# Altium project wulpus_hv_mux.PrjPcb
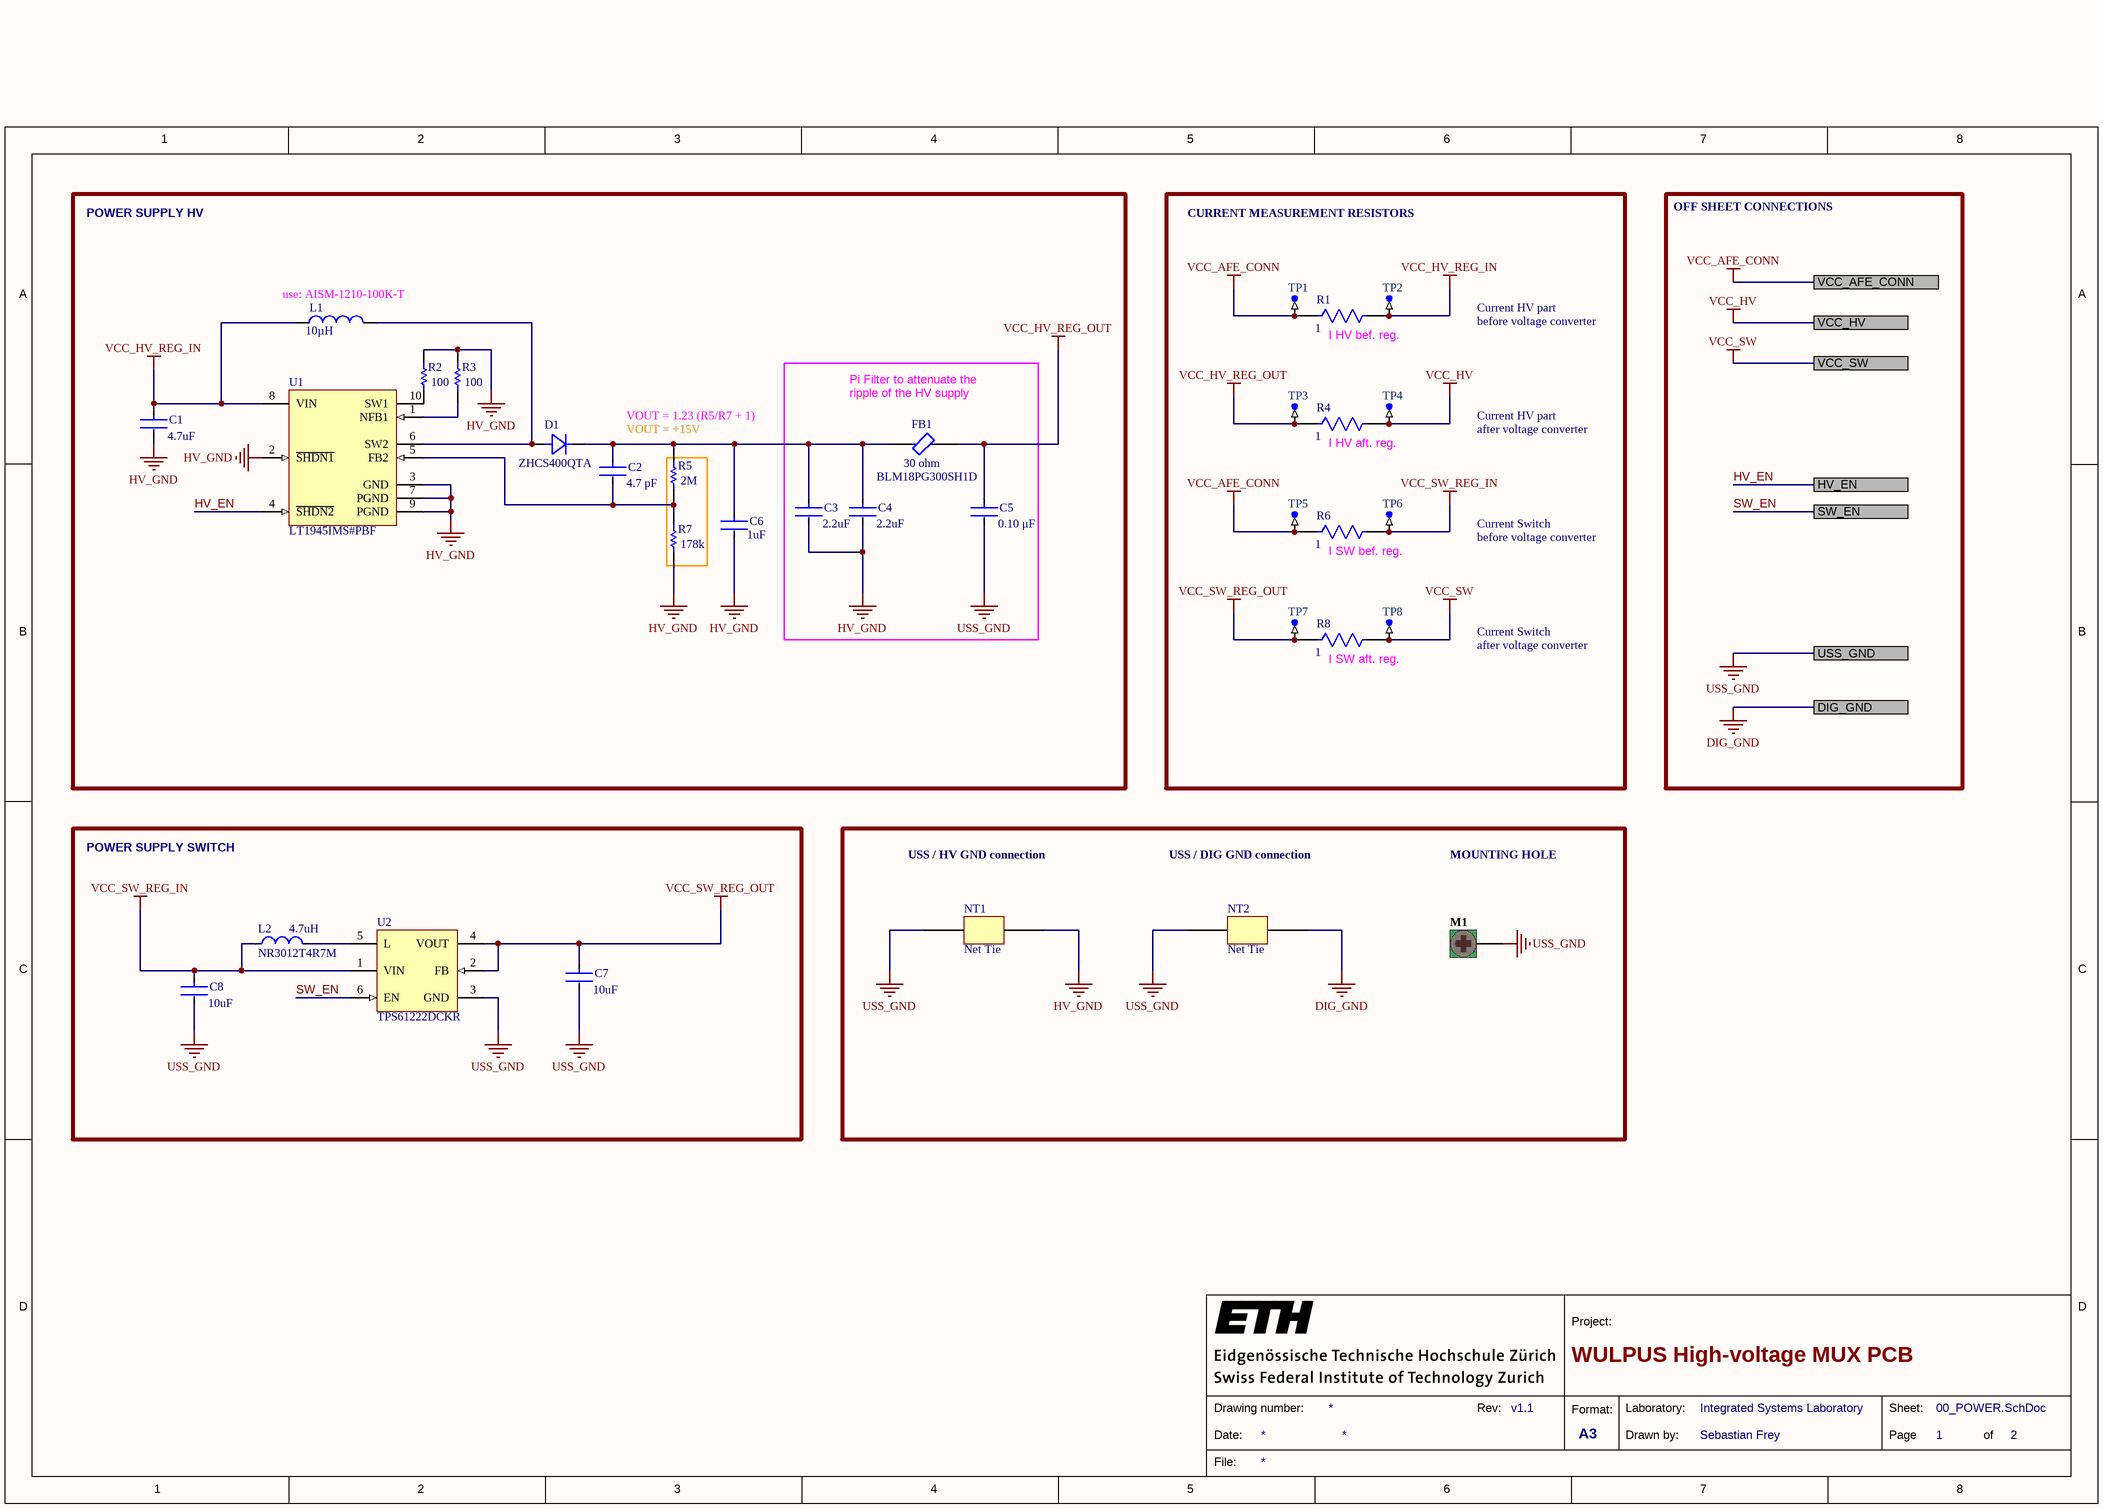
[diagram p0: 00_POWER.SchDoc]
2 sheets, 71 parts. Net scope: flat (ports and power ports of the same name join across sheets).
Board file: PCB1.PcbDoc
Sheets:
  00_POWER.SchDoc
  01_TRANSDUCERS.SchDoc

## Sheet 00_POWER.SchDoc: WULPUS High-voltage MUX PCB
size A3; DrawnBy: Sebastian Frey; Organization: Integrated Systems Laboratory; Revision: v1.1; SheetNumber: 1; SheetTotal: 2

### Parts
C1  Capacitance: 4.7uF  [FP-0603-L_1_6_0_15-W_0_81-MFG]  (hidden comment: 06036D475KAT2A)
C2  Capacitance: 4.7 pF  [FP-C0402-BB-MFG]  (hidden comment: C0402C479C5GACTU)
C3  Capacitance: 2.2uF  [FP-GRM188-0_2-IPC_C]  (hidden comment: GRM188R61H225KE11D)
C4  Capacitance: 2.2uF  [FP-GRM188-0_2-IPC_C]  (hidden comment: GRM188R61H225KE11D)
C5  value 0.10 μF  [FP-C0603C-CF-MFG]  (hidden comment: C0603C104M5RACTU)
C6  Capacitance: 1uF  [FP-1206-L_3_2_0_15-W_1_6-IPC_B]  (hidden comment: GMK316BJ105KLHT)
C7  Capacitance: 10uF  [FP-GRM188-0_1-e0_2_0_55-IPC_A]  (hidden comment: GRM188R60J106ME47D)
C8  Capacitance: 10uF  [FP-GRM188-0_1-e0_2_0_55-IPC_A]  (hidden comment: GRM188R60J106ME47D)
D1  ZHCS400QTA  [DIODE_SOD323_DIO]
FB1  BLM18PG300SH1D  Impedance: 30 ohm  [FP-BLM18-0_15-t0_8-IPC_A]
L1  Inductance: 10µH  [TDK-B82422A1103K100_V]  (hidden comment: B82422A1103K100)
L2  NR3012T4R7M  Inductance: 4.7uH  [FP-NR3012-MFG]
M1  Mounting Hole for AFE PCB  [Hole M2]  (value not drawn)  (no BOM)
NT1  Net Tie  [Net_Tie_Top_Bottom]  (net tie, no BOM)
NT2  Net Tie  [Net_Tie_Top_Bottom]  (net tie, no BOM)
R1  Resistance: 1  [FP-CSR0402-MFG]  (hidden comment: CSR0402FK1R00)
R2  Resistance: 100  [RESC1005X40X25NL05T05]  (hidden comment: ERJ-2GEJ101X)
R3  Resistance: 100  [RESC1005X40X25NL05T05]  (hidden comment: ERJ-2GEJ101X)
R4  Resistance: 1  [FP-CSR0402-MFG]  (hidden comment: CSR0402FK1R00)
R5  Resistance: 2M  [RESC1005X40X25NL05T10]  (hidden comment: RC0402FR-072ML)
R6  Resistance: 1  [FP-CSR0402-MFG]  (hidden comment: CSR0402FK1R00)
R7  Resistance: 178k  [RESC1005X40X25ML05T05]  (hidden comment: ERJ-2RKF1783X)
R8  Resistance: 1  [FP-CSR0402-MFG]  (hidden comment: CSR0402FK1R00)
TP1  TP-SM-C-100  [TP-SM-C-100]  (value not drawn)  (no BOM)
TP2  TP-SM-C-100  [TP-SM-C-100]  (value not drawn)  (no BOM)
TP3  TP-SM-C-100  [TP-SM-C-100]  (value not drawn)  (no BOM)
TP4  TP-SM-C-100  [TP-SM-C-100]  (value not drawn)  (no BOM)
TP5  TP-SM-C-100  [TP-SM-C-100]  (value not drawn)  (no BOM)
TP6  TP-SM-C-100  [TP-SM-C-100]  (value not drawn)  (no BOM)
TP7  TP-SM-C-100  [TP-SM-C-100]  (value not drawn)  (no BOM)
TP8  TP-SM-C-100  [TP-SM-C-100]  (value not drawn)  (no BOM)
U1  LT1945IMS#PBF  [LT-MS-10_L]
U2  TPS61222DCKR  [DCK0006A_L]

### Blocks framed on the sheet
POWER SUPPLY SWITCH: C7 C8 L2 U2

### Ports
DIG_GND, HV_EN, SW_EN, USS_GND, VCC_AFE_CONN, VCC_HV, VCC_SW

### Nets
DIG_GND: NT2.2 ; port DIG_GND
HV_GND: C1.2 C3.2 C4.2 C6.2 NT1.2 R2.2 R3.2 R7.1 U1.2(~{SHDN1}) U1.3(GND) U1.7(PGND) U1.9(PGND)
USS_GND: C5.2 C7.2 C8.2 M1.1 NT1.1 NT2.1 U2.3(GND) ; port USS_GND
VCC_AFE_CONN: R1.1 R6.1 TP1.1 TP5.1 ; port VCC_AFE_CONN
VCC_HV: R4.2 TP4.1 ; port VCC_HV
VCC_HV_REG_IN: C1.1 L1.1 R1.2 TP2.1 U1.8(VIN)
VCC_HV_REG_OUT: C5.1 FB1.2 R4.1 TP3.1
VCC_SW: R8.2 TP8.1 ; port VCC_SW
VCC_SW_REG_IN: C8.1 L2.1 R6.2 TP6.1 U2.1(VIN)
VCC_SW_REG_OUT: C7.1 R8.1 TP7.1 U2.2(FB) U2.4(VOUT)
HV_EN: U1.4(~{SHDN2}) ; port HV_EN
SW_EN: U2.6(EN) ; port SW_EN
NetC2_1: C2.1 C3.1 C4.1 C6.1 D1.1 FB1.1 R5.2
NetC2_2: C2.2 R5.1 R7.2 U1.5(FB2)
NetD1_2: D1.2 L1.2 U1.6(SW2)
NetL2_2: L2.2 U2.5(L)
NetR2_1: R2.1 U1.10(SW1)
NetR3_1: R3.1 U1.1(NFB1)

### Notes on the sheet
- POWER SUPPLY HV
- CURRENT MEASUREMENT RESISTORS
- OFF SHEET CONNECTIONS
- (near L1) use: AISM-1210-100K-T
- Current HV part
- (near R1) I HV bef. reg.
- before voltage converter
- VOUT = 1.23 (R5/R7 + 1)
- VOUT = +15V
- (near FB1) Pi Filter to attenuate the ripple of the HV supply
- (near R4) I HV aft. reg.
- after voltage converter
- (near R6) I SW bef. reg.
- Current Switch
- (near R8) I SW aft. reg.
- USS / HV GND connection
- USS / DIG GND connection
- MOUNTING HOLE
- 1
- 2
- 3
- 4
- 5
- 6
- 7
- 8
- A
- B
- C
- D
- Project:
- Date:
- Drawing number:
- Rev:
- Format:
- A3
- Drawn by:
- Laboratory:
- Page
- Sheet:
- of
- File:

### Library data of the parts
C1 = CMP-2006-04481-2: General Purpose Ceramic Capacitor, 0603, 4.7uF, 10%, X5R, 15%, 6.3V; Tolerance: 20%; Voltage Rating (DC): 6.3V; RoHS Compliant: Yes; Thickness: 0.035inch; Voltage: 6.3V; Number of Pins: 2; Case Code (Metric): 1608; Dielectric: X5R; Height: 0.9mm; Case Code (Imperial): 0603; Contact Plating: Tin; REACH SVHC: No SVHC; Package Quantity: 1; Case/Package: 0603; Lead Free: Lead Free; Series: -; Termination: SMD/SMT; Mount: Surface Mount; Min Operating Temperature: -55°C; Construction: Flat; Packaging: Tape and Reel; Max Operating Temperature: 85°C; Dielectric Material: Ceramic; Voltage Rating: 6.3V; Length: 1.6mm; Depth: 0.81mm; Radiation Hardening: No; Width: 0.032inch
C2 = CMP-2008-03310-2: CAP CER 4.7PF 50V NP0 0402; Manufacturer: Kemet; Material: Ceramic; Tolerance: 0.25 pF; Temperature Coefficient: 15%; Temperature Characteristic: C0G; Manufacturer Part Number: C0402C479C5GACTU; Lead Free: Yes; Device Class L1: Passive Components; ComponentLink2Description: Datasheet; Temperature: -55°C to +125°C; Digikey Description: CAP CER 4.7PF 50V NP0 0402; Ipc Land Pattern Name: CAPC10050X50; ComponentLink2URL: https://content.kemet.com/datasheets/KEM_C1002_X7R_SMD.pdf; Octopart: https://octopart.com/c0402c479c5gactu-kemet-9144199; Mouser Description: Multilayer Ceramic Capacitors MLCC - SMD/SMT 50volts 4.7pF C0G .25pF; Automotive: No; Voltage Rating: 50 V; Device Class L3: Ceramic Capacitors; Category: Cap; Value: 4.7 pF; Package: C0402-BB; Height: 0.55mm; Temperature Range Low: -55°C; RoHS: TRUE; Device Class L2: Capacitors; Temperature Range High: +125°C
C3 C4 = CMP-06035-042125-1: Chip Multilayer Ceramic Capacitors for General Purpose, 0603, 2.2uF, X5R, 15%, 10%, 50V; Case Code (Metric): 1608; Packaging: Cut Tape; REACH SVHC: No SVHC; Material: Ceramic; Voltage Rating: 50V; Min Operating Temperature: -55°C; Length: 0.063inch; Case Code (Imperial): 0603; Tolerance: 10%; Thickness: 0.039inch; Height: 0.8mm; Case/Package: 0603; Voltage Rating (DC): 50V; Dielectric: X5R; Mount: Surface Mount; Max Operating Temperature: 85°C; Width: 0.031inch
C5 = CMP-2006-03068-2: CAP CER 0.1UF 50V 20% X7R 0603; Manufacturer: KEMET; Material: Ceramic; Tolerance: 0.2; Temperature Coefficient: 30ppm/°C; Automotive Grade: Grade 1; Temperature Range High: +125°C; Voltage Rating: 50 V; Device Class L3: Ceramic Capacitors; Manufacturer Part Number: C0603C104M5RACTU; Height: 0.87mm; Category: Cap; RoHS: TRUE; Digikey Description: CAP CER 0.1UF 50V 20% X7R 0603; ComponentLink2URL: https://api.kemet.com/component-edge/download/datasheet/C0603C100J5GACAUTO.pdf; Lead Free: Yes; Temperature Range Low: -55°C; Device Class L1: Passive Components; ComponentLink2Description: Datasheet; Temperature Characteristic: X7R; Automotive: Yes; Temperature: -55°C to +125°C; Octopart: https://octopart.com/c0603c104m5ractu-kemet-11855687; Device Class L2: Capacitors; Package: C0603C-CF; Mouser Description: Multilayer Ceramic Capacitors MLCC - SMD/SMT 50volts 0.1uF X7R 20%; Capacitance: 0.10 μF
C6 = CMP-14477-003256-2: None; Voltage Rating (DC): 35V; Dielectric: X5R; Tolerance: 10%; Halogen Free: Halogen Free; Max Operating Temperature: 85°C; Min Operating Temperature: -55°C; Termination: SMD/SMT; Length: 0.126inch; Package Quantity: 2000; Voltage Rating: 35V; Width: 0.063inch; Case/Package: 1206; Case Code (Imperial): 1206; Case Code (Metric): 3216; Mount: Surface Mount; Packaging: Tape and Reel; Ratings: AEC-Q200; RoHS Compliant: Yes; Height: 1.6mm; Lead Free: Lead Free; Thickness: 0.071inch
C7 C8 = CMP-2006-02792-2: Chip Multilayer Ceramic Capacitors for General Purpose, 0603, 10uF, X5R, 15%, 20%, 6.3V; Packaging: Tape and Reel; Voltage Rating (DC): 6.3V; Width: 0.031inch; Termination: SMD/SMT; Dielectric: X5R; Package Quantity: 4000; Voltage Rating: 6.3V; Case/Package: 0603; Min Operating Temperature: -55°C; Voltage: 6.3V; Length: 1.6mm; Thickness: 0.035inch; Lead Free: Lead Free; Depth: 0.8mm; Case Code (Imperial): 0603; Max Operating Temperature: 85°C; Material: Ceramic; Height: 0.8mm; Tolerance: 20%; Mount: Surface Mount; REACH SVHC: No SVHC; Radiation Hardening: No; Case Code (Metric): 1608
D1 = ZHCS400QTA: Diode Schottky 40V 1A Automotive 2-Pin SOD-323 T/R; Manufacturer: Diodes; Supplier 1: Farnell; RoHS: Yes; Category: Rectifier Diodes; Stock 1: 385; Pricing 1: 5=0.87300, 10=0.73400, 100=0.49400, 500=0.38800 (CHF); Mount: Surface Mount; Packaging: Tape and Reel; Average Rectified Current: 1A; Max Reverse Voltage (DC): 40V; RoHS Compliant: Yes; ComponentLink1URL: http://www.mouser.com/ds/2/115/ZHCS400Q-959646.pdf?src-supplier=Mouser; ComponentLink1Description: http://www.mouser.com/ds/2/115/ZHCS400Q-959646.pdf?src-supplier=Mouser; Supplier Part Number 1: 3127490; Manufacturer Part Number: ZHCS400QTA
FB1 = CMP-06046-000808-1: Chip Ferrite Bead, 0603, 30Ω @ 100MHz, 0.05Ω, , 1A; Tolerance: 25%; Shielding: Unshielded; DC Resistance (DCR): 50mR; Number of Lines: 1; Width: 0.031inch; Termination: SMD/SMT; Case Code (Metric): 1608; Max DC Current: 1A; Case Code (Imperial): 0603; Height: 0.037inch; Max Operating Temperature: 125°C; Max Current Rating: 1A; Case/Package: 0603; Length: 1.6mm; Number of Circuits: 1; Test Frequency: 100MHz; Contact Plating: Tin; Ratings: AEC-Q200; Package Quantity: 1; Mount: Surface Mount; Packaging: Tape and Reel; Min Operating Temperature: -55°C
L1 = CMP-2000-05912-1: Wirewound Inductor, 10 uF, +/- 10%, 180 mA, -55 to 125 degC, 2-Pin SMD, RoHS, Tape and Reel; Manufacturer: EPCOS-(TDK); Frequency - Test: 1MHz; Current Rating: 180mA; Material - Core: Ferrite; DC Resistance (DCR): 1.6OhmMax; Q @ Freq: 27@2.52MHz; Frequency - Self Resonant: 25MHz; Shielding: Unshielded; Series: SIMID; Size / Dimension: 0.126"Lx0.098"W(3.20mmx2.50mm); Mounting Type: SurfaceMount; Current - Saturation: -; Operating Temperature: -; Datasheet URL: https://en.tdk.eu/inf/30/db/ind_2008/b82422a_100.pdf; Ratings: AEC-Q200; Category: Inductors,Coils,Chokes; Mounting Technology: SurfaceMount; Height - Seated (Max): 0.083"(2.10mm); Family: FixedInductors; Package / Case: 1210(3225Metric); Tolerance: ±10%; Manufacturer URL: http://www.tdk.com/; Datasheet Version: 10/2012; Type: Wirewound; Packaging: CutTape(CT); Package Description: 2-Pin Surface Mount Device, Body 3.2 x 2.5 mm; Package Reference: B82422A1103K100
L2 = CMP-14484-001484-1: SMD Power Inductors 4.7uH ±20% 0.77A 0.13Ω; Saturation Current: 770mA; Self Resonant Frequency: 48MHz; RMS Current (Irms): 980mA; Test Frequency: 100kHz; Core Material: Ferrite; Shielding: Shielded; DC Resistance (DCR): 156mR; Series: NR; Case Code (Metric): 3030; Halogen Free: Halogen Free; Tolerance: 20%; Resistor Type: Wirewound; Mount: Surface Mount; Case/Package: 1212; Max DC Current: 770mA; Length: 0.118inch; Height - Seated (Max): 0.047inch; Termination: SMD/SMT; Package Quantity: 2000; DC Current: 980mA; Depth: 3.1mm; Packaging: Tape and Reel; Height: 1.2mm; Current Rating: 980mA; Min Operating Temperature: -25°C; Case Code (Imperial): 1212; Lead Free: Lead Free; Military Standard: Not; Width: 0.118inch; Max Operating Temperature: 120°C; Radiation Hardening: No; Inductance Tolerance: 20%; RoHS Compliant: Yes
M1 = CMP-00274-1: M2 Hole, 2.4mm drill, 5mm landing pads, 3mm pad in middle layers, no overlay; ClassName: Mounting Hole
NT1 NT2 = Net_Tie
R1 R4 R6 R8 = CMP-26527-000038-1: RES 1 OHM 1% 1/8W 0402; Max Power Dissipation: 125mW; Temperature Coefficient: 200ppm/°C; Max Operating Temperature: 155°C; RoHS Compliant: Yes; Case Code (Imperial): 0402; Package Quantity: 1000; Mount: Surface Mount; Width: 0.02inch; Case/Package: 0402; Packaging: Tape and Reel; Resistor Type: Thick Film; Tolerance: 1%; Length: 0.039inch; Case Code (Metric): 1005; Min Operating Temperature: -55°C; Number of Terminations: 2; Series: CSR; Height: 0.017inch
R2 R3 = CMP-2002-00431-1: Manufacturer: Panasonic; Part Number: ERJ-2GEJ101X
R5 = CMP-2002-07066-1: Manufacturer: Yageo / Phycomp; Part Number: RC0402FR-072ML
R7 = CMP-2002-00733-1: Manufacturer: Panasonic; Part Number: ERJ-2RKF1783X
TP1-TP8 = CMP-0484-00002-1: Test Point, Surface Mount, Circular, Pad Diameter 1 mm
U1 = CMP-0478-00154-1: Dual Micropower DC/DC Converter with Positive and Negative Outputs, 1.2 to 15 V Vin, 10-pin SOP (MS-10), -40 to 125 degC, Pb-Free; Manufacturer: Linear Technology; Vin Min(V): 1.2; Vin Max(V): 15; Number of Outputs: 2; Mounting Technology: Surface Mount; ComponentLink3Description: Package Specification; ComponentLink3URL: http://cds.linear.com/docs/en/packaging/05081661_F_MS.pdf; PackageVersion: Rev. E, 06/2010; ComponentLink2URL: http://cds.linear.com/docs/en/datasheet/1945fa.pdf; PartNumber: LT1945IMS#PBF; DatasheetVersion: Rev. A; PackageReference: MS-10; PackageDescription: 10-Pin Plastic MSOP, Body 3 x 3 mm, Pitch 0.5 mm; ComponentLink2Description: Datasheet; RoHS: TRUE; ComponentLink1URL: http://www.linear.com/; ComponentLink1Description: Manufacturer URL
U2 = CMP-0347-00055-2: Boost Voltage Converter with 0.7 to 5.5 V Input and 5 V Output, -40 to 85 degC, 6-Pin SC70 (DCK), Green (RoHS & no Sb/Br); Manufacturer: Texas Instruments; Vout(Min)(V): 5; SubFamily: Step-Up Regulator; Vin(Min)(V): 0.7; Switching Frequency(Max)(kHz): 2000; Regulated Outputs(#): 1; Vin(Max)(V): 5.5; Topology: Boost; Vout(Max)(V): 5; PackageVersion: revG, Jan-2007; Mounting Technology: Surface Mount; ComponentLink2URL: http://www.ti.com/litv/pdf/mpds114c; PackageReference: DCK0006A; DatasheetVersion: SLVS776; PartNumber: TPS61222DCKR; ComponentLink1Description: Datasheet; ComponentLink1URL: http://www.ti.com/general/docs/lit/getliterature.tsp?genericPartNumber=TPS61222&fileType=pdf; ComponentLink2Description: Package Specification; Eco-Plan: Green (RoHS & no Sb/Br); Code_JEDEC: MO-203-AB; PackageDescription: 6-Pin Plastic Small-Outline Package, 2 x 1.3 mm Body, 0.65 mm Pitch, 2.1 mm Lead Span

## Sheet 01_TRANSDUCERS.SchDoc: WULPUS High-voltage MUX PCB
size A3; DrawnBy: Sebastian Frey; Organization: Integrated Systems Laboratory; Revision: v1.1; SheetNumber: 2; SheetTotal: 2
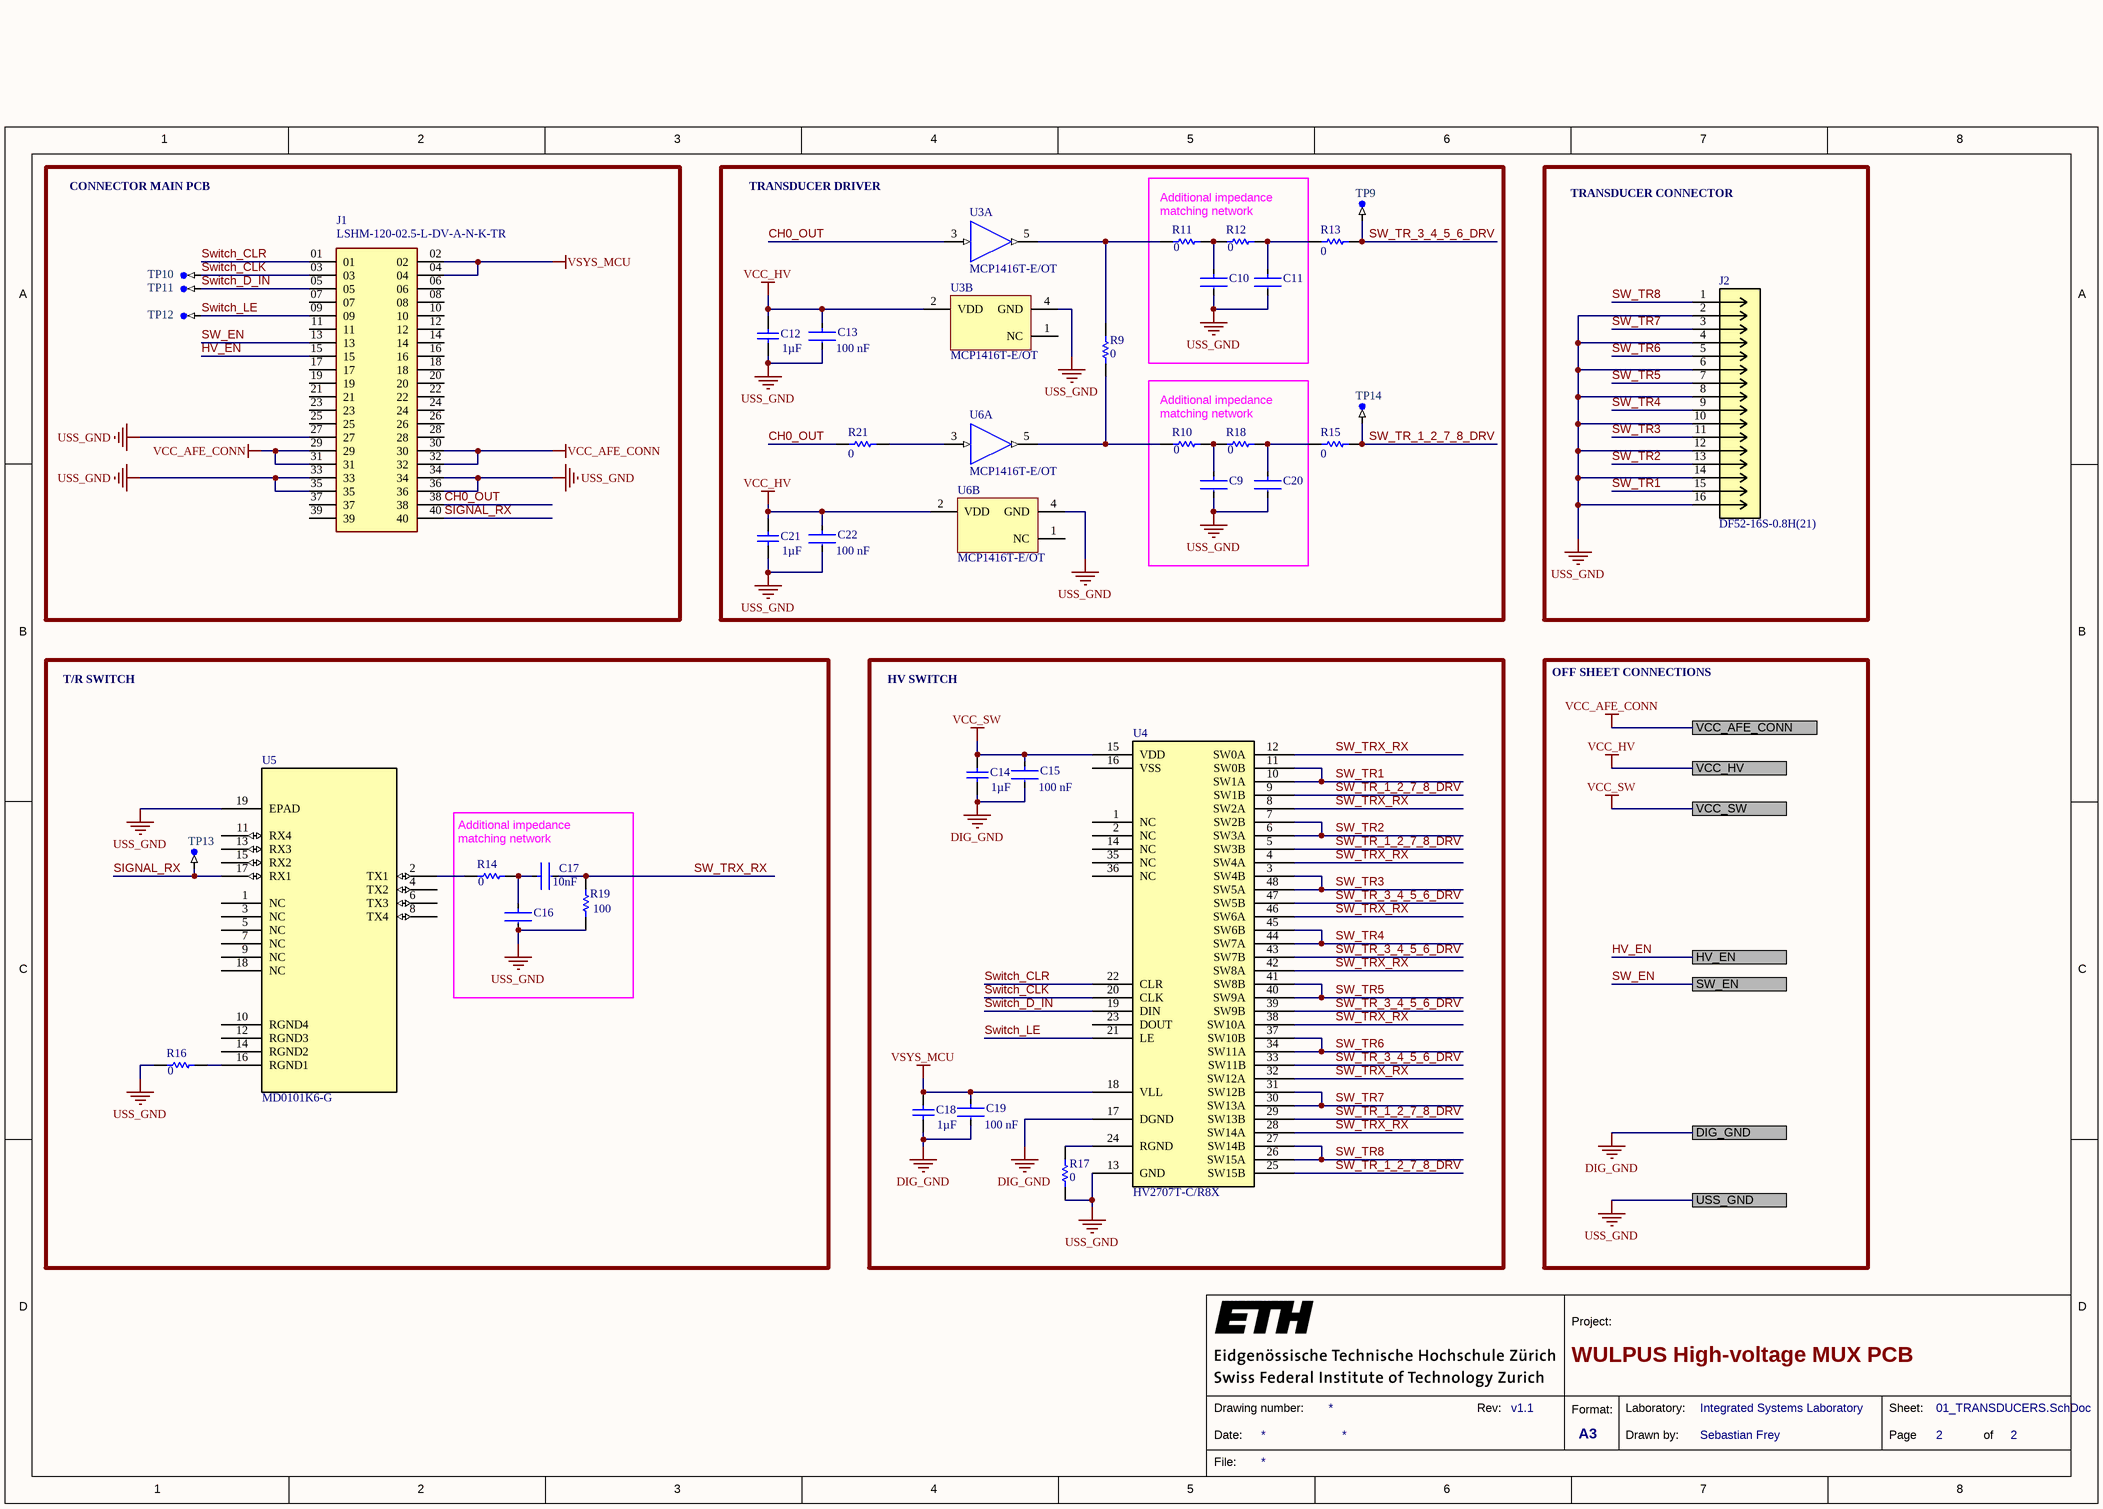
[diagram p1: 01_TRANSDUCERS.SchDoc]

### Parts
C9  CC0603KRX7R9BB104  [FP-CC0603-DA-MFG]  (value not drawn)
C10  CC0603KRX7R9BB104  [FP-CC0603-DA-MFG]  (value not drawn)
C11  CC0603KRX7R9BB104  [FP-CC0603-DA-MFG]  (value not drawn)
C12  Capacitance: 1µF  [CAPC1608X90X20LL10]  (hidden comment: C1608X5R1H105K080AB)
C13  Capacitance: 100 nF  [FP-CC0603-DA-MFG]  (hidden comment: CC0603KRX7R9BB104)
C14  Capacitance: 1µF  [CAPC1608X90X20LL10]  (hidden comment: C1608X5R1H105K080AB)
C15  Capacitance: 100 nF  [FP-CC0603-DA-MFG]  (hidden comment: CC0603KRX7R9BB104)
C16  CC0603KRX7R9BB104  [FP-CC0603-DA-MFG]  (value not drawn)
C17  Capacitance: 10nF  [FP-CL165-IPC_C]  (hidden comment: CL05B103KB5NNNC)
C18  Capacitance: 1µF  [CAPC1608X90X20LL10]  (hidden comment: C1608X5R1H105K080AB)
C19  Capacitance: 100 nF  [FP-CC0603-DA-MFG]  (hidden comment: CC0603KRX7R9BB104)
C20  CC0603KRX7R9BB104  [FP-CC0603-DA-MFG]  (value not drawn)
C21  Capacitance: 1µF  [CAPC1608X90X20LL10]  (hidden comment: C1608X5R1H105K080AB)
C22  Capacitance: 100 nF  [FP-CC0603-DA-MFG]  (hidden comment: CC0603KRX7R9BB104)
J1  LSHM-120-02.5-L-DV-A-N-K-TR  [SAMTEC_LSHM-120-XX.X-X-DV-A-N-XX]
J2  DF52-16S-0.8H(21)  [CONN_DF52-16S-0.8H(21)_HIR]
R9  Resistance: 0  [RESC1005X40X25NL05T10]  (hidden comment: RC0402JR-070RL)
R10  Resistance: 0  [RESC1005X40X25NL05T10]  (hidden comment: RC0402JR-070RL)
R11  Resistance: 0  [RESC1005X40X25NL05T10]  (hidden comment: RC0402JR-070RL)
R12  Resistance: 0  [RESC1005X40X25NL05T10]  (hidden comment: RC0402JR-070RL)
R13  Resistance: 0  [RESC1005X40X25NL05T10]  (hidden comment: RC0402JR-070RL)
R14  Resistance: 0  [RESC1005X40X25NL05T10]  (hidden comment: RC0402JR-070RL)
R15  Resistance: 0  [RESC1005X40X25NL05T10]  (hidden comment: RC0402JR-070RL)
R16  Resistance: 0  [RESC1005X40X25NL05T10]  (hidden comment: RC0402JR-070RL)
R17  Resistance: 0  [RESC1005X40X25NL05T10]  (hidden comment: RC0402JR-070RL)
R18  Resistance: 0  [RESC1005X40X25NL05T10]  (hidden comment: RC0402JR-070RL)
R19  Resistance: 100  [RESC1005X40X25NL05T05]  (hidden comment: ERJ-2GEJ101X)
R21  Resistance: 0  [RESC1005X40X25NL05T10]  (hidden comment: RC0402JR-070RL)
TP9  TP-SM-C-100  [TP-SM-C-100]  (value not drawn)  (no BOM)
TP10  TP-SM-C-100  [TP-SM-C-100]  (value not drawn)  (no BOM)
TP11  TP-SM-C-100  [TP-SM-C-100]  (value not drawn)  (no BOM)
TP12  TP-SM-C-100  [TP-SM-C-100]  (value not drawn)  (no BOM)
TP13  TP-SM-C-100  [TP-SM-C-100]  (value not drawn)  (no BOM)
TP14  TP-SM-C-100  [TP-SM-C-100]  (value not drawn)  (no BOM)
U3  MCP1416T-E/OT  [SOT-23-OT5_M]  (parts A,B of 2)
U4  HV2707T-C/R8X  [LQFP48_7X7MC_MCH]
U5  MD0101K6-G  [DFN18_5X5_MCH]
U6  MCP1416T-E/OT  [SOT-23-OT5_M]  (parts A,B of 2)

### Blocks framed on the sheet
CONNECTOR MAIN PCB: J1 TP10-TP12
TRANSDUCER DRIVER: C9-C13 C20-C22 R9-R13 R15 R18 R21 TP9 TP14 U3 U6
TRANSDUCER CONNECTOR: J2
T/R SWITCH: C16 C17 R14 R16 R19 TP13 U5
HV SWITCH: C14 C15 C18 C19 R17 U4

### Ports
DIG_GND, HV_EN, SW_EN, USS_GND, VCC_AFE_CONN, VCC_HV, VCC_SW

### Nets
DIG_GND: C14.1 C15.2 C18.1 C19.2 U4.17(DGND) ; port DIG_GND
USS_GND: C9.2 C10.2 C11.2 C12.1 C13.2 C16.2 C20.2 C21.1 C22.2 J1.27 J1.33 J1.34 J1.35 J1.36 J2.2 J2.4 J2.6 J2.8 J2.10 J2.12 J2.14 J2.16 R16.2 R17.2 R19.1 U3.4(GND) U4.13(GND) U5.19(EPAD) U6.4(GND) ; port USS_GND
VCC_AFE_CONN: J1.29 J1.30 J1.31 J1.32 ; port VCC_AFE_CONN
VCC_HV: C12.2 C13.1 C21.2 C22.1 U3.2(VDD) U6.2(VDD) ; port VCC_HV
VCC_SW: C14.2 C15.1 U4.15(VDD) ; port VCC_SW
VSYS_MCU: C18.2 C19.1 J1.02 J1.04 U4.18(VLL)
CH0_OUT: J1.38 R21.1 U3.3(IN)
HV_EN: J1.15 ; port HV_EN
SIGNAL_RX: J1.40 TP13.1 U5.17(RX1)
SW_EN: J1.13 ; port SW_EN
SW_TR1: J2.15 U4.10(SW1A) U4.11(SW0B)
SW_TR2: J2.13 U4.6(SW3A) U4.7(SW2B)
SW_TR3: J2.11 U4.3(SW4B) U4.48(SW5A)
SW_TR4: J2.9 U4.44(SW7A) U4.45(SW6B)
SW_TR5: J2.7 U4.40(SW9A) U4.41(SW8B)
SW_TR6: J2.5 U4.34(SW11A) U4.37(SW10B)
SW_TR7: J2.3 U4.30(SW13A) U4.31(SW12B)
SW_TR8: J2.1 U4.26(SW15A) U4.27(SW14B)
SW_TR_1_2_7_8_DRV: R15.2 TP14.1 U4.5(SW3B) U4.9(SW1B) U4.25(SW15B) U4.29(SW13B)
SW_TR_3_4_5_6_DRV: R13.2 TP9.1 U4.33(SW11B) U4.39(SW9B) U4.43(SW7B) U4.47(SW5B)
SW_TRX_RX: C17.2 R19.2 U4.4(SW4A) U4.8(SW2A) U4.12(SW0A) U4.28(SW14A) U4.32(SW12A) U4.38(SW10A) U4.42(SW8A) U4.46(SW6A)
Switch_CLK: J1.03 TP10.1 U4.20(CLK)
Switch_CLR: J1.01 U4.22(CLR)
Switch_D_IN: J1.05 TP11.1 U4.19(DIN)
Switch_LE: J1.09 TP12.1 U4.21(LE)
NetC9_1: C9.1 R10.1 R18.2
NetC10_1: C10.1 R11.1 R12.2
NetC11_1: C11.1 R12.1 R13.1
NetC16_1: C16.1 C17.1 R14.1
NetC20_1: C20.1 R15.1 R18.1
NetR9_1: R9.1 R11.2 U3.5(OUT)
NetR9_2: R9.2 R10.2 U6.5(OUT)
NetR14_2: R14.2 U5.2(TX1)
NetR16_1: R16.1 U5.16(RGND1)
NetR17_1: R17.1 U4.24(RGND)
NetR21_2: R21.2 U6.3(IN)

Not connected (* = marked no-connect by the designer): J1 06 07 08 10 11 12 14 16 17 18 19 20 21 22 23 24 25 26 28 37 39; U3 1(NC); U4 1(NC) 2(NC) 14(NC) 16(VSS) 23(DOUT) 35(NC) 36(NC); U5 1(NC) 3(NC) 4(TX2) 5(NC) 6(TX3) 7(NC) 8(TX4) 9(NC) 10(RGND4) 11(RX4) 12(RGND3) 13(RX3) 14(RGND2) 15(RX2) 18(NC); U6 1(NC)

### Notes on the sheet
- Additional impedance matching network
- OFF SHEET CONNECTIONS
- 1
- 2
- 3
- 4
- 5
- 6
- 7
- 8
- A
- B
- C
- D
- Project:
- Date:
- Drawing number:
- Rev:
- Format:
- A3
- Drawn by:
- Laboratory:
- Page
- Sheet:
- of
- File:

### Library data of the parts
C9-C11 C16 C20 = CMP-2100-03601-2: CAP CER 0.1UF 50V X7R 0603; Manufacturer: YAGEO; Material: Ceramic; Capacitance: 100 nF; Temperature Coefficient: 15%; Tolerance: 0.1; Value: 100 nF; Height: 0.9mm; Voltage: 50 V; ComponentLink2Description: Datasheet; Device Class L2: Capacitors; Temperature Range High: +125°C; Category: Cap; Footprint Url: http://www.yageo.com/exep/pages/download/literatures/UPY-C_GEN_24.pdf; ComponentLink2URL: http://www.yageo.com/documents/recent/UPY-GPHC_X7R_6.3V-to-50V_18.pdf; Package: CC0603-DA; Temperature: -55°C to +125°C; Voltage Rating: 50 V; Temperature Characteristic: X7R; Device Class L1: Passive Components; Temperature Range Low: -55°C; Manufacturer Part Number: CC0603KRX7R9BB104; RoHS: TRUE; Automotive: No; Device Class L3: Ceramic Capacitors; Octopart: https://octopart.com/cc0603krx7r9bb104-yageo-42244635; Mouser Description: Multilayer Ceramic Capacitor, CC Series, 0.1 - F, - 10%, X7R, 50 V, 0603 [1608 Metric]; Lead Free: Yes; Digikey Description: CAP CER 0.1UF 50V X7R 0603
C12 C14 C18 C21 = CMP-2000-06025-1: Chip Capacitor, 1 uF, +/- 10%, 50 V, -55 to 85 degC, 0603 (1608 Metric), RoHS, Tape and Reel; Manufacturer: TDK; PCN Part Number: MLCCPartNumberChange30/Nov/2012; Other Names: 445-7468-6; Online Catalog: CSeries,GeneralPurpose; Product Training Modules: CSeriesGeneralApplicationsSEAT,CCV,andTVCLDesignToolsGuidetoReplacinganElectrolyticCapacitorwithanMLCC; Voltage - Rated: 50V; Design Resources: 20WNon-IsolatedBuckLEDDriverUsingPLLNK460KG; Temperature Coefficient: X5R; Series: C; Datasheet Version: 08/2016; Package Description: 2-Pin Surface Mount Device, Body 1.6 x 0.8 mm; Mounting Technology: SurfaceMount; Features: -; Size / Dimension: 0.063"Lx0.031"W(1.60mmx0.80mm); Lead Spacing: -; Operating Temperature: -55°C~85°C; Tolerance: ±10%; Height - Seated (Max): -; Mounting Type: SurfaceMount,MLCC; Ratings: -; Standard Package: 1; Applications: GeneralPurpose; Datasheet URL: https://product.tdk.com/info/en/catalog/datasheets/mlcc_commercial_general_en.pdf; Category: Capacitors; Lead Style: -; Packaging: Digi-Reel®; RoHS Information: RoHSCertificate-MLCC; Package / Case: 0603(1608Metric); Package Reference: 0603; Manufacturer URL: http://www.tdk.com/; Thickness (Max): 0.035"(0.90mm); Family: CeramicCapacitors
C13 C15 C19 C22 = CMP-2100-03601-2: CAP CER 0.1UF 50V X7R 0603; Manufacturer: YAGEO; Material: Ceramic; Temperature Coefficient: 15%; Tolerance: 0.1; Value: 100 nF; Height: 0.9mm; Voltage: 50 V; ComponentLink2Description: Datasheet; Device Class L2: Capacitors; Temperature Range High: +125°C; Category: Cap; Footprint Url: http://www.yageo.com/exep/pages/download/literatures/UPY-C_GEN_24.pdf; ComponentLink2URL: http://www.yageo.com/documents/recent/UPY-GPHC_X7R_6.3V-to-50V_18.pdf; Package: CC0603-DA; Temperature: -55°C to +125°C; Voltage Rating: 50 V; Temperature Characteristic: X7R; Device Class L1: Passive Components; Temperature Range Low: -55°C; Manufacturer Part Number: CC0603KRX7R9BB104; RoHS: TRUE; Automotive: No; Device Class L3: Ceramic Capacitors; Octopart: https://octopart.com/cc0603krx7r9bb104-yageo-42244635; Mouser Description: Multilayer Ceramic Capacitor, CC Series, 0.1 - F, - 10%, X7R, 50 V, 0603 [1608 Metric]; Lead Free: Yes; Digikey Description: CAP CER 0.1UF 50V X7R 0603
C17 = CMP-13271-000387-1: Cap Ceramic 10nF 50V X7R ±10% SMD 0402 +125°C Paper T/R; Depth: 0.5mm; Length: 1mm; Lead Free: Lead Free; Case Code (Metric): 1005; Width: 0.02inch; Min Operating Temperature: -55°C; Thickness: 0.022inch; Package Quantity: 1; Mount: Surface Mount; Height: 0.5mm; Voltage: 50V; Material: Ceramic; Tolerance: 10%; Case Code (Imperial): 0402; Radiation Hardening: No; Case/Package: 0402; Max Operating Temperature: 125°C; Voltage Rating (DC): 50V; Contact Plating: Tin; Packaging: Tape and Reel; Voltage Rating: 50V; Dielectric: X7R
J1 = LSHM-120-02.5-L-DV-A-N-K-TR: Conn Socket and Terminal Strip HDR/SKT 40 POS 0.5mm Solder ST SMD T/R; Manufacturer: Samtec; Number of Contacts: 40; Supplier 1: Digi-Key; RoHS: Yes; Category: Connectors; Stock 1: 3008; Pricing 1: 1=6.60000, 10=5.97000, 25=5.63960, 50=5.50200, 100=5.22690, 250=4.67672 (USD); Contact Plating: Gold; Contact Material: Bronze; Housing Color: Black; Housing Material: Polymer; Min Operating Temperature: -55°C; Max Operating Temperature: 125°C; Number of Rows: 2; Termination: Solder; Packaging: Tape and Reel; Orientation: Straight; Series: LSH; Length: 14.7mm; Pitch: 0.5mm; Depth: 4.98mm; Radiation Hardening: No; REACH SVHC: No SVHC; RoHS Compliant: Yes; ComponentLink1URL: http://www.farnell.com/datasheets/2372721.pdf?src-supplier=Farnell; ComponentLink1Description: http://www.farnell.com/datasheets/2372721.pdf?src-supplier=Farnell; ComponentLink2URL: http://www.farnell.com/datasheets/2000266.pdf?src-supplier=Farnell; ComponentLink2Description: http://www.farnell.com/datasheets/2000266.pdf?src-supplier=Farnell; ComponentLink3URL: http://components.arrow.com/part/dataview/0323_01943898?src-supplier=Arrow+Europe; ComponentLink3Description: http://components.arrow.com/part/dataview/0323_01943898?src-supplier=Arrow+Europe; ComponentLink4URL: http://components.arrow.com/part/dataview/48680868S8397842N1004?src-supplier=Arrow+Electronics; ComponentLink4Description: http://components.arrow.com/part/dataview/48680868S8397842N1004?src-supplier=Arrow+Electronics; ComponentLink5URL: http://www.farnell.com/datasheets/2000266.pdf?src-supplier=Element14; ComponentLink5Description: http://www.farnell.com/datasheets/2000266.pdf?src-supplier=Element14; ComponentLink6URL: http://suddendocs.samtec.com/prints/lshm-1xx-xx.x-xx-dv-a-x-x-tr-mkt.pdf?src-supplier=Digi-Key; ComponentLink6Description: http://suddendocs.samtec.com/prints/lshm-1xx-xx.x-xx-dv-a-x-x-tr-mkt.pdf?src-supplier=Digi-Key; ComponentLink7URL: ftp://ftp.samtec.com/webfiles/PDF/LSHM.PDF?src-supplier=Avnet; ComponentLink7Description: ftp://ftp.samtec.com/webfiles/PDF/LSHM.PDF?src-supplier=Avnet; ComponentLink8URL: ftp://ftp.samtec.com/webfiles/PDF/LSHM.PDF?src-supplier=Avnet+Europe; ComponentLink8Description: ftp://ftp.samtec.com/webfiles/PDF/LSHM.PDF?src-supplier=Avnet+Europe; ComponentLink9URL: http://www.farnell.com/datasheets/2372721.pdf?src-supplier=Newark; ComponentLink9Description: http://www.farnell.com/datasheets/2372721.pdf?src-supplier=Newark; Supplier Part Number 1: SAM13196CT-ND; Manufacturer Part Number: LSHM-120-02.5-L-DV-A-N-K-TR
J2 = DF52-16S-0.8H(21): No Description Available; Mfr_Name: Hirose; Copyright: Copyright (C) 2022 Ultra Librarian. All rights reserved.; Manufacturer_Part_Number: DF52-16S-0.8H(21); RefDes: RefDes; Type: DEV
R9-R18 R21 = CMP-1011-00001-2: Manufacturer: Yageo / Phycomp; Part Number: RC0402JR-070RL
R19 = CMP-2002-00431-1: Manufacturer: Panasonic; Part Number: ERJ-2GEJ101X
TP9-TP14 = CMP-0484-00002-1: as TP1 on sheet 00_POWER
U3 U6 = CMP-0137-00410-1: Tiny 1.5A, High-Speed Power MOSFET Driver, Non Inverting, Extended Temperature, Tape and Reel; PackageDescription: 5-Lead Plastic Small Outline Transistor (OT) [SOT-23]; Code_IPC: SOT23-5; PackageVersion: revBB, Aug-2009; PackageReference: SOT-23-OT5; DatasheetVersion: revC, Dec-2008
U4 = HV2707T-C/R8X: 16-CH 200V No Hv Bias Switch (SPST), 2 Bleed Resistor 48 LQFP 7X7X1.4MM T/r Rohs Compliant: Yes; Manufacturer: Microchip; Supplier 1: Digi-Key; RoHS: Yes; Category: Decoders and Multiplexers; Stock 1: 440; Pricing 1: 1=19.01000, 25=15.84720, 100=14.65500 (USD); Manufacturer Part Number: HV2707T-C/R8X
U5 = MD0101K6-G: No Description Available; Mfr_Name: Microchip; Copyright: Copyright (C) 2022 Ultra Librarian. All rights reserved.; Manufacturer_Part_Number: MD0101K6-G; RefDes: RefDes; Type: DEV

## Nets that join several sheets
DIG_GND: 00_POWER (NT2.2), 01_TRANSDUCERS (5 pins)
USS_GND: 00_POWER (7 pins), 01_TRANSDUCERS (29 pins)
VCC_AFE_CONN: 00_POWER (R1.1 R6.1 TP1.1 TP5.1), 01_TRANSDUCERS (J1.29 J1.30 J1.31 J1.32)
VCC_HV: 00_POWER (R4.2 TP4.1), 01_TRANSDUCERS (6 pins)
VCC_SW: 00_POWER (R8.2 TP8.1), 01_TRANSDUCERS (C14.2 C15.1 U4.15)
HV_EN: 00_POWER (U1.4), 01_TRANSDUCERS (J1.15)
SW_EN: 00_POWER (U2.6), 01_TRANSDUCERS (J1.13)

## Assembly variants
Only fitted: all parts fitted